# EasyEDA Pro project PCB工程源文件_第一组.eprj

# Schematic Schematic1
Board Name: Board1; Create Date: 2025-12-11; Page Name: P1; Project Name: 高频课设最终版本12-19-3; Schematic Name: Schematic1; Update Date: 2025-12-11; Company: 嘉立创EDA; Page Size: A4; Version: V1.0
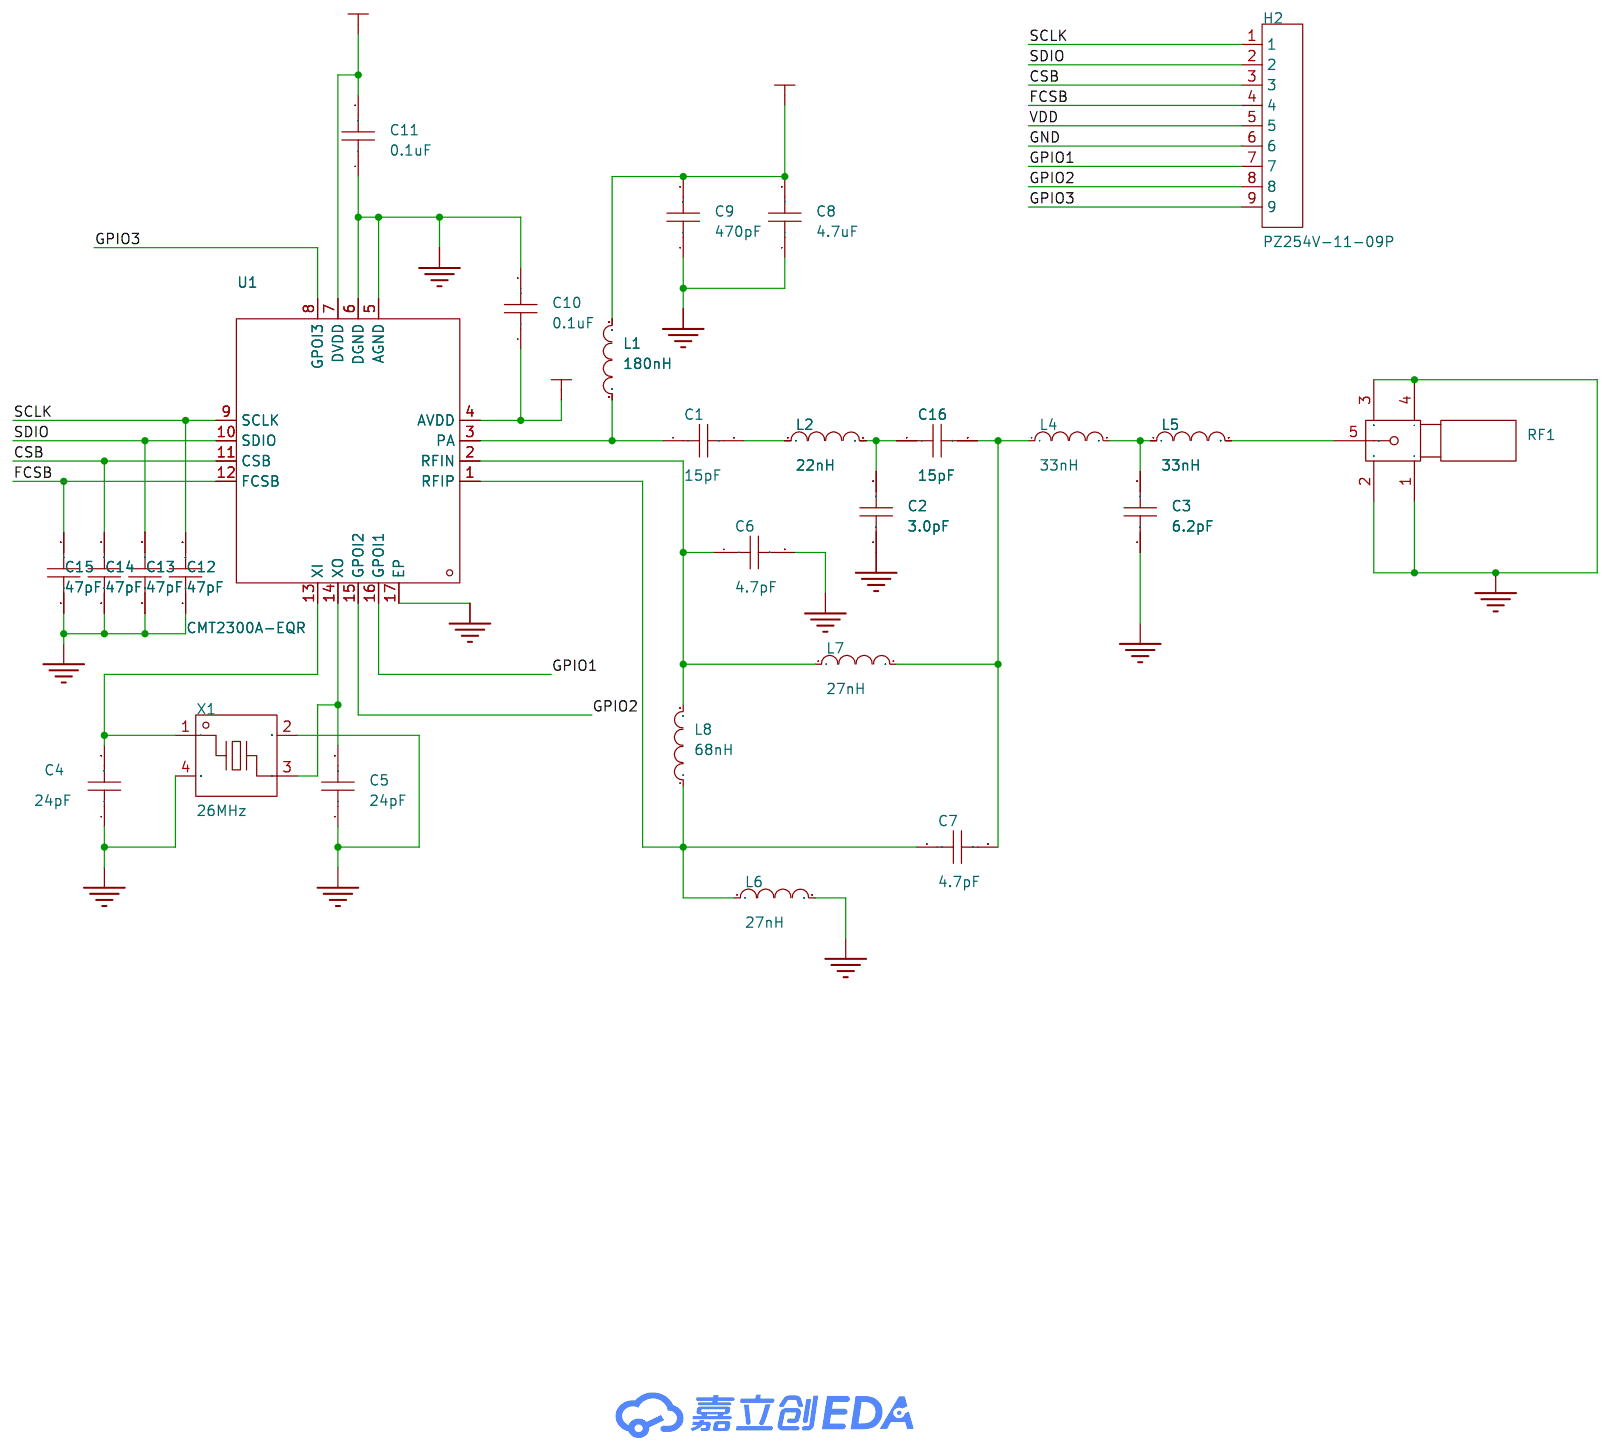
[diagram p0: schematic sheet]

## Parts
C1  15pF  [C0603]
C2  3.0pF  [C0603]
C3  6.2pF  [C0603]
C4  24pF  [C0603]
C5  24pF  [C0603]
C6  4.7pF  [C0603]
C7  4.7pF  [C0603]
C8  4.7uF  [C0603]
C9  470pF  [C0603]
C10  0.1uF  [C0603]
C11  0.1uF  [C0603]
C12  47pF  [C0603]
C13  47pF  [C0603]
C14  47pF  [C0603]
C15  47pF  [C0603]
C16  15pF  [C0603]
H2  PZ254V-11-09P  [HDR-TH_9P-P2.54-V-M]
L1  180nH  [L0603]
L2  22nH  [L0603]
L4  33nH  [L0603]
L5  33nH  [L0603]
L6  27nH  [L0603]
L7  27nH  [L0603]
L8  68nH  [L0603]
RF1  -  [SMA-TH_BWSMA-KE-Z001]
U1  CMT2300A-EQR  [QFN-16_L3.0-W3.0-P0.50-BL-EP1.7]
X1  26MHz  [CRYSTAL-SMD_4P-L3.2-W2.5-BL]

## Library data of the parts
C1-C16 = CAP_0603: Supplier Footprint: 0603
H2 = PZ254V-11-09P: 插针结构:1x9P;间距:2.54mm;行距:-;圆针/方针:方针;安装方式:直插;排数:单排;总PIN位数:9P;额定电流:-;额定电压:-;配合针长度:6mm;塑高:2.5mm;端接针长度:3mm;触头材质:黄铜;触头镀层:-;工作温度:-40℃~+105℃;颜色:黑色;; LCSC Part Name: 1x9P 间距:2.54mm 方针 直插; Supplier Part: C492408; Manufacturer: XFCN(兴飞); Supplier Footprint: 插件,P=2.54mm; JLCPCB Part Class: 扩展库; Datasheet: https://item.szlcsc.com/datasheet/PZ254V-11-09P/502964.html; Supplier: LCSC; Pin Structure: 1x9P; Pitch: 2.54mm; Circluar Pins/Square Pins: 方针; Mounting Type: 直插; Number of Rows: 单排; Number of Pins: 9P; Length of Mating Pin: 6mm; Insulation Height: 2.5mm; Length of End Connection Pin: 3mm; Contact Material: 黄铜; Operating Temperature: -40℃~+105℃; Color: 黑色
L1 L2 L4-L8 = L_0603
RF1 = BWSMA-KE-Z001_C496549: 连接器类型:板端;接口类型:内孔;端口数量:1;接口直径:-;接口长度/高度:-;频率:-;射频系列:SMA;阻抗:50Ω;样式:正脚;工作温度:-65℃~+165℃;; LCSC Part Name: 内孔 SMA 正脚; Supplier Part: C496549; Manufacturer: BAT WIRELESS(蝙蝠无线); Manufacturer Part: BWSMA-KE-Z001; Supplier Footprint: 插件; JLCPCB Part Class: 扩展库; Datasheet: https://item.szlcsc.com/datasheet/BWSMA-KE-Z001/508498.html; Supplier: LCSC; Connector Type: 板端; Interface: 内孔; Number of Ports: 1; RF Series: SMA; Impedance: 50Ω; Style: 正脚; Operating Temperature Range: -65℃~+165℃
U1 = CMT2300A-EQR: 频率范围:127MHz~1.02GHz;接口类型:SPI;应用领域:ISM;数据速率:300Kbps;灵敏度:-121dBm;典型应用频率:433.92MHz;; LCSC Part Name: 超低功耗 Sub-1GHz 射频收发器; Supplier Part: C192930; Manufacturer: HOPERF(华普微电子); Supplier Footprint: QFN-16-EP(3x3); JLCPCB Part Class: 扩展库; Datasheet: https://item.szlcsc.com/datasheet/CMT2300A-EQR/225900.html; Supplier: LCSC; Frequency Range: 127MHz~1.02GHz; Interface: SPI; Voltage - Supply: 1.8V~3.6V; Applications: ISM; Output Power: 20dBm; Data Rate: 300Kbps; Current Of Transmitting: 23mA; Sensitivity: -121dBm; Receive Current: 8.5mA; Typical Application Frequency: 433.92MHz; Operating Temperature: -40℃~+85℃
X1 = TAXM26M4RHBCCT2T: 晶振类型:贴片晶振;频率:26MHz;常温频差:±10ppm;负载电容:15pF;频率稳定度:±15ppm;; LCSC Part Name: 26MHz ±10ppm 15pF; Supplier Part: C516065; Manufacturer: YJX(雅晶鑫); Supplier Footprint: SMD3225-4P; JLCPCB Part Class: 扩展库; Datasheet: https://item.szlcsc.com/datasheet/TAXM26M4RHBCCT2T/531914.html; Supplier: LCSC; Type: 贴片晶振; Normal temperature Frequency Tolerance: ±10ppm; Load Capacitance: 15pF; Frequency Stability: ±15ppm; Equivalent Series Resistance(ESR): 40Ω; Operating Temperature: -40℃~+85℃

## Nets
GND: C2.1 C3.1 C4.1 C5.1 C6.2 C8.1 C9.1 C10.2 C11.1 C12.1 C13.1 C14.1 C15.1 H2.6 L6.2 RF1.1 RF1.2 RF1.3 RF1.4 U1.5(AGND) U1.6(DGND) U1.17(EP) X1.2(GND) X1.4(GND)
VDD: C8.2 C9.2 C10.1 C11.2 H2.5 L1.2 U1.4(AVDD) U1.7(DVDD)
CSB: C14.2 H2.3 U1.11(CSB)
FCSB: C15.2 H2.4 U1.12(FCSB)
GPIO1: H2.7 U1.16(GPOI1)
GPIO2: H2.8 U1.15(GPOI2)
GPIO3: H2.9 U1.8(GPOI3)
SCLK: C12.2 H2.1 U1.9(SCLK)
SDIO: C13.2 H2.2 U1.10(SDIO)
$1N691: C4.2 U1.13(XI) X1.1
$1N1791: C1.1 L1.1 U1.3(PA)
$1N1847: C1.2 L2.1
$1N1852: C2.2 C16.1 L2.2
$1N1857: C7.2 C16.2 L4.1 L7.2
$1N1862: C3.2 L4.2 L5.1
$1N1900: C6.1 L7.1 L8.2 U1.2(RFIN)
$1N2046: C7.1 L6.1 L8.1 U1.1(RFIP)
$1N3838: L5.2 RF1.5
$1N5992: C5.2 U1.14(XO) X1.3

# Board PCB1
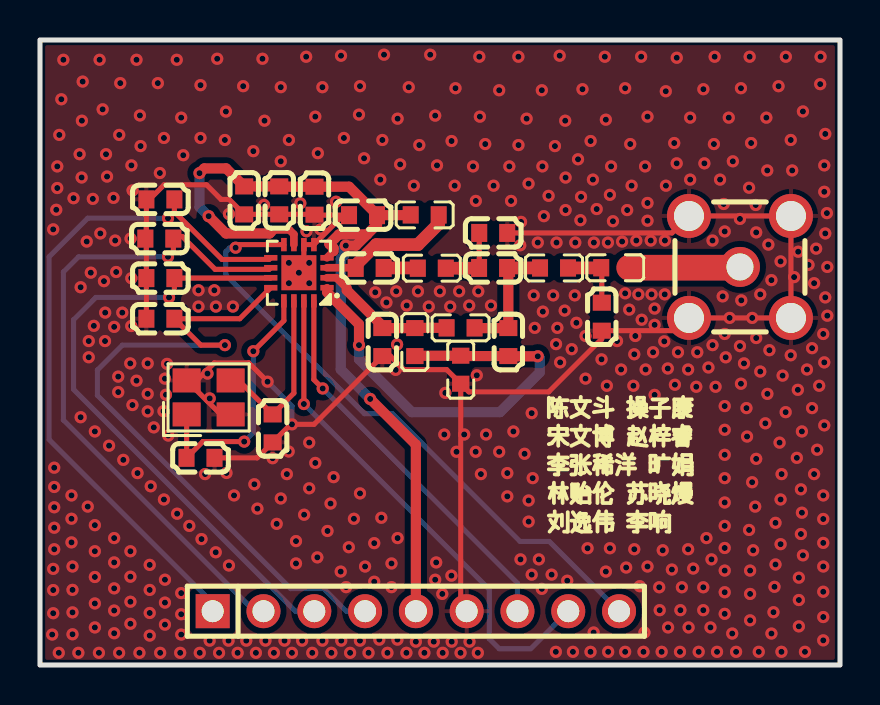
[diagram p1: board, top side]
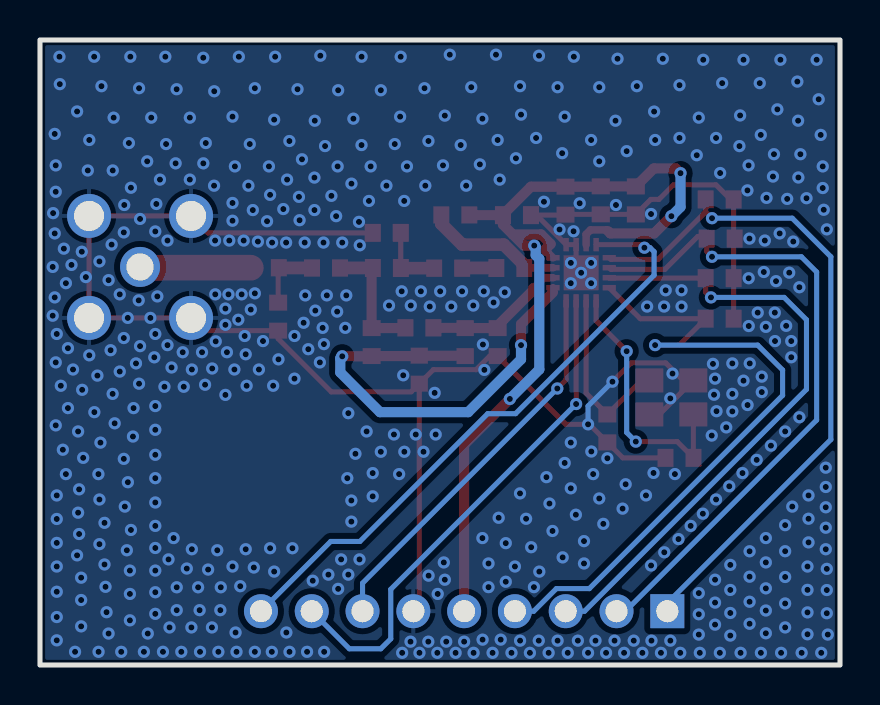
[diagram p2: board, bottom side, seen from below]

Outline 40.01 x 31.27 mm; copper layers: Top Layer, Bottom Layer. Coordinates in mm from the lower left corner of the outline.
Outline path: rectangle 40.01,0 0,31.27
Stack: Top Layer 0.035mm / Dielectric1 1.51mm FR4 er 4.5 / Bottom Layer 0.035mm

## Design rules (mm)
template: 自定义配置
spacing copperThickness1oz (default): track to track 0.102, other pairs 0.152 to 0.3
spacing copperThickness2oz: track to track 0.203, other pairs 0.152 to 0.3
track width copperThickness1oz (default): min 0.127, default 0.254, max 2.54
track width copperThickness2oz: min 0.203, default 0.254, max 2.54
differential pair differentialPair (default): width min 0.127, default 0.254, max 2.54; gap min 0.152, default 0.152
via viaSize (default): diameter min 0.5, default 0.61, max 10; hole min 0.3, default 0.305, max 6.3
net GND uses copperRegion1

## Placement (name value [footprint] x y rotation side)
C1  15pF  [C0603]  16.48 19.86 0 top
C2  3.0pF  [C0603]  22.66 21.62 180 top
C3  6.2pF  [C0603]  28.09 17.42 90 top
C4  24pF  [C0603]  8.03 10.36 180 top
C5  24pF  [C0603]  11.63 11.84 90 top
C6  4.7pF  [C0603]  17.12 16.15 270 top
C7  4.7pF  [C0603]  23.42 16.15 90 top
C8  4.7uF  [C0603]  13.73 23.23 90 top
C9  470pF  [C0603]  16.15 22.5 0 top
C10  0.1uF  [C0603]  11.96 23.24 270 top
C11  0.1uF  [C0603]  10.21 23.24 90 top
C12  47pF  [C0603]  6.02 23.29 0 top
C13  47pF  [C0603]  5.97 21.33 0 top
C14  47pF  [C0603]  6.02 19.35 0 top
C15  47pF  [C0603]  6.02 17.32 0 top
C16  15pF  [C0603]  22.66 19.86 0 top
H2  PZ254V-11-09P  [HDR-TH_9P-P2.54-V-M]  18.8 2.69 0 top
L1  180nH  [L0603]  19.24 22.52 180 top
L2  22nH  [L0603]  19.59 19.85 0 top
L4  33nH  [L0603]  25.7 19.86 0 top
L5  33nH  [L0603]  28.76 19.87 0 top
L6  27nH  [L0603]  21.04 14.77 270 top
L7  27nH  [L0603]  21.03 16.87 0 top
L8  68nH  [L0603]  18.75 16.15 90 top
RF1  -  [SMA-TH_BWSMA-KE-Z001]  35 19.91 0 top
U1  CMT2300A-EQR  [QFN-16_L3.0-W3.0-P0.50-BL-EP1.7]  12.95 19.62 90 top
X1  26MHz  [CRYSTAL-SMD_4P-L3.2-W2.5-BL]  8.43 13.39 0 top

## Footprints (pads in the part's own frame, mm; a bottom-side part is the same pattern mirrored in y, then rotated)
C0603
  rect 0.8x0.9 smd: 1(-0.7,0) 2(0.7,0)
CRYSTAL-SMD_4P-L3.2-W2.5-BL
  rect 1.4x1.2 smd: 1(-1.1,-0.85) 2(1.1,-0.85) 3(1.1,0.85) 4(-1.1,0.85)
HDR-TH_9P-P2.54-V-M
  rect 1.7x1.7 hole 1.1: 1(-10.16,0)
  round 1.7 hole 1.1: 2(-7.62,0) 3(-5.08,0) 4(-2.54,0) 5(0,0) 6(2.54,0) 7(5.08,0) 8(7.62,0) 9(10.16,0)
L0603
  rect 0.8x0.864 smd: 1(-0.7,0) 2(0.7,0)
QFN-16_L3.0-W3.0-P0.50-BL-EP1.7
  rect 0.28x0.665 smd: 1(-0.75,-1.407) 2(-0.25,-1.407) 3(0.25,-1.407) 4(0.75,-1.407) 9(0.75,1.407) 10(0.25,1.407) 11(-0.25,1.407) 12(-0.75,1.407)
  rect 0.665x0.28 smd: 5(1.407,-0.75) 6(1.407,-0.25) 7(1.407,0.25) 8(1.407,0.75) 13(-1.407,0.75) 14(-1.407,0.25) 15(-1.407,-0.25) 16(-1.407,-0.75)
  rect 1.75x1.75 smd: 17(0,0)
SMA-TH_BWSMA-KE-Z001
  round 2.2 hole 1.5: 1(-2.55,-2.55) 2(-2.55,2.55) 3(2.55,2.55) 4(2.55,-2.55)
  round 2 hole 1.35: 5(0,0)

## Nets
As in the schematic.

## Via types
v1: diameter 0.61, hole 0.305, Top Layer to Bottom Layer, 552 vias

## Routing (per net, layer and track width the routed paths; a pad name or vN(x,y) marks a point on that pad's centre or on a via; arc(x,y) is an arc through that point)
GND: length 96.1
  Top Layer w0.254: 15.17,22.5 U1.5 U1.6 13.2,19.87 v1(12.95,19.62) ; 15.17,22.5 13.75,22.5 C8.1 13.71,22.54 C10.2 10.21,22.54 C11.1 9.46,23.29 9.05,23.29 8.33,24.02 6.2,24.02 5.48,23.29 C12.1 5.32,21.38 C13.1 5.32,21.28 C14.1 C15.1 ; 15.17,22.5 C9.1 ; C4.1 10.86,10.36 C5.1 12.54,12.04 v1(12.6,12.04) 13.7,12.04 C6.2 17.52,15.45 18.2,14.78 20.34,14.78 L6.2 ; C2.1 31.6,21.62 RF1.2 RF1.3 RF1.4 v1(35.62,17.36) v1(34.48,17.36) RF1.1 31.81,16.72 C3.1 28.09,16.32 25.44,13.67 21.45,13.67 L6.2 ; X1.2 9.03,12.54 X1.4 7.84,14.24 8.72,15.11 10.44,15.11 v1(11.38,14.17) ; L6.2 21.04,2.99 H2.6
  Bottom Layer w0.254: v1(11.38,14.17) 12.6,12.95 v1(12.6,12.04)
  vias: v1(0.61,1.52) v1(0.66,21.79) v1(0.71,9.87) v1(0.71,8.91) v1(0.71,7.89) v1(0.71,6.87) v1(0.71,5.79) v1(0.66,4.81) v1(0.66,3.75) v1(0.66,2.59) v1(0.81,22.77) v1(0.86,24.94) v1(0.86,23.86) v1(0.94,0.61) v1(0.97,26.52) v1(1.07,28.3) v1(1.17,30.28) v1(1.58,8.48) v1(1.58,7.32) v1(1.58,6.13) v1(1.63,4.93) v1(1.63,3.76) v1(1.63,2.63) v1(1.63,1.54) v1(1.68,23.35) v1(1.92,0.61) v1(1.98,25.55) v1(2.03,18.9) v1(2.03,12.4) v1(2.13,29.19) v1(2.09,27.23) v1(2.08,24.39) v1(2.34,21.18) v1(2.44,16.21) v1(2.44,15.4) v1(2.39,7.92) v1(2.54,19.63) v1(2.64,23.32) v1(2.69,16.97) v1(2.74,11.68) v1(2.74,7) v1(2.74,5.69) v1(2.74,4.4) v1(2.74,3.08) v1(2.74,1.88) v1(2.98,30.28) v1(3.02,21.59) v1(2.95,0.61) v1(3.13,27.8) v1(3.2,19.2) v1(3.3,25.55) v1(3.26,17.63) v1(3.25,16.21) v1(3.35,24.44) v1(3.45,10.97) v1(3.68,23.37) v1(3.71,16.92) v1(3.71,6.35) v1(3.71,5.13) v1(3.71,3.83) v1(3.71,2.73) v1(3.71,1.59) v1(3.76,21.23) v1(3.81,19.66) v1(3.91,14.43) v1(3.91,13.65) v1(4.01,29.11) v1(3.96,26.52) v1(3.96,0.61) v1(4.11,17.63) v1(4.17,10.26) v1(4.53,21.33) v1(4.51,15.09) v1(4.52,5.69) v1(4.52,4.42) v1(4.52,3.17) v1(4.52,2.06) v1(4.57,24.99) v1(4.63,23.74) v1(4.57,19.35) v1(4.56,16.96) v1(4.62,13) v1(4.83,30.28) v1(4.83,14.22) v1(4.88,9.6) v1(5,27.49) v1(5.03,25.96) v1(4.97,0.61) v1(5.39,15.09) v1(5.39,13.56) v1(5.39,12.69) v1(5.54,8.94) v1(5.49,5.01) v1(5.49,3.76) v1(5.49,2.6) v1(5.49,1.47) v1(5.69,11.89) v1(5.89,29.11) v1(5.99,24.61) v1(6.01,0.61) v1(6.2,26.37) v1(6.18,12.7) v1(6.2,8.28) v1(6.25,14.33) v1(6.3,13.52) v1(6.25,4.27) v1(6.25,3.12) v1(6.25,2.02) v1(6.35,15.06) v1(6.41,11.48) v1(6.84,30.28) v1(6.86,7.57) v1(7.01,0.61) v1(7.06,27.38) v1(7.06,3.6) v1(7.06,2.54) v1(7.06,1.52) v1(7.16,25.5) v1(7.47,6.96) v1(7.92,18.75) v1(7.92,17.93) v1(8.03,29.01) v1(8.03,26.37) v1(7.99,0.61) v1(8.08,6.3) v1(8.26,9.55) v1(8.38,14.58) v1(8.49,13.34) v1(8.48,1.22) v1(8.72,18.75) v1(8.8,17.93) v1(8.79,5.64) v1(8.86,30.33) v1(8.95,0.61) v1(9.3,27.69) v1(9.24,26.26) v1(9.33,9.61) v1(9.43,1.22) v1(9.45,22.56) v1(9.45,4.98) v1(9.65,17.93) v1(9.7,8.48) v1(9.88,0.61) v1(10.16,28.96) v1(10.31,1.22) v1(10.67,25.7) v1(10.72,9.04) v1(10.8,0.61) v1(10.87,7.82) v1(11.13,30.33) v1(11.23,27.23) v1(11.2,23.01) v1(11.27,1.22) v1(11.63,10.34) v1(11.7,0.61) v1(11.84,7.06) v1(12.04,28.91) v1(12.04,25.2) v1(12.04,8.33) v1(12.23,1.22) v1(12.43,10.68) v1(12.34,9.55) v1(12.45,26.26) v1(12.45,20.12) v1(12.45,19.1) v1(12.6,0.61) v1(12.8,6.2) v1(12.8,5.08) v1(13.02,23.1) v1(13.11,1.22) v1(13.21,7.52) v1(13.31,30.43) v1(13.32,21.7) v1(13.46,20.12) v1(13.46,19.1) v1(13.46,11.13) v1(13.46,8.84) v1(13.61,0.61) v1(13.77,27.43) v1(13.77,10.11) v1(13.89,25.6) v1(13.87,5.38) v1(14.03,21.79) v1(14.12,28.91) v1(14.12,1.22) v1(14.38,6.71) v1(14.53,8.08) v1(14.57,0.61) v1(14.68,9.4) v1(14.8,23.17) v1(15.04,4.67) v1(15.05,30.48) v1(15.06,1.22) v1(15.2,26.37) v1(15.31,3.89) v1(15.44,5.89) v1(15.51,0.61) v1(15.7,7.32) v1(16,28.96) v1(15.95,27.53) v1(16,8.59) v1(16,1.22) v1(16.21,25.35) v1(16.26,4.93) v1(16.43,0.61) v1(16.71,6.1) v1(16.71,4.17) v1(16.76,18.64) v1(17.02,24.28) v1(16.97,1.27) v1(17.12,26.26) v1(17.07,7.37) v1(17.2,30.53) v1(17.32,18.14) v1(17.37,0.61) v1(17.58,5.08) v1(17.58,3.89) v1(17.81,18.69) v1(17.79,14.76) v1(17.88,27.33) v1(17.86,16.03) v1(17.88,6.35) v1(17.87,1.27) v1(18.01,25.04) v1(18.34,17.98) v1(18.32,0.61) v1(18.44,28.91) v1(18.69,23.98) v1(18.8,1.17) v1(18.9,18.69) v1(18.97,26.01) v1(19.22,0.61) v1(19.44,17.93) v1(19.51,30.53) v1(19.69,1.17) v1(19.76,27.48) v1(19.81,5.13) v1(19.76,4.27) v1(19.85,24.99) v1(19.99,18.69) v1(20.12,3.56) v1(20.14,0.61) v1(20.22,11.53) v1(20.27,13.61) v1(20.51,17.93) v1(20.58,26.21) v1(20.57,4.47) v1(20.59,1.17) v1(20.74,23.98) v1(20.78,28.85) v1(20.83,10.67) v1(20.96,18.69) v1(21.03,0.61) v1(21.21,11.53) v1(21.46,17.98) v1(21.48,1.17) v1(21.65,24.94) v1(21.79,23.22) v1(21.84,14.49) v1(21.79,10.67) v1(21.92,18.69) v1(21.89,0.61) v1(21.97,30.43) v1(22,27.43) v1(22.05,9.55) v1(22.26,26.06) v1(22.3,11.53) v1(22.55,17.98) v1(22.68,23.98) v1(22.96,28.75) v1(22.96,10.67) v1(23.37,9.6) v1(23.37,8.44) v1(23.47,24.94) v1(23.56,23.22) v1(23.67,11.68) v1(23.92,30.43) v1(23.93,26.01) v1(24.01,21) v1(24.03,5.28) v1(24.05,22.17) v1(24.23,10.57) v1(24.33,27.33) v1(24.43,24.08) v1(24.43,8.23) v1(24.43,7.17) v1(24.59,12.6) v1(24.64,9.35) v1(24.59,4.52) v1(24.69,18.49) v1(24.74,16.87) v1(24.89,21.13) v1(24.95,5.28) v1(25.1,28.75) v1(25.12,24.94) v1(25.1,3.81) v1(25.2,22.45) v1(25.15,17.68) v1(25.43,23.47) v1(25.58,4.52) v1(25.66,18.49) v1(25.75,25.96) v1(25.83,21.13) v1(25.81,16.05) v1(25.8,0.66) v1(25.87,16.87) v1(25.99,30.48) v1(26.01,15.14) v1(26.24,17.73) v1(26.26,27.23) v1(26.28,24.38) v1(26.28,22.76) v1(26.37,4.22) v1(26.59,15.8) v1(26.74,18.49) v1(26.65,0.66) v1(26.77,21.13) v1(26.82,17.12) v1(26.9,25.3) v1(27.02,22.25) v1(27.13,28.8) v1(27.06,23.42) v1(27.28,16.46) v1(27.28,14.33) v1(27.38,5.84) v1(27.53,26.21) v1(27.53,0.66) v1(27.65,24.28) v1(27.7,21.13) v1(27.69,1.63) v1(27.84,22.81) v1(28.08,15.29) v1(28.25,30.43) v1(28.3,27.28) v1(28.3,4.67) v1(28.4,21.13) v1(28.35,13.97) v1(28.41,0.66) v1(28.5,23.52) v1(28.5,5.84) v1(28.56,24.94) v1(28.65,22.2) v1(28.85,16.21) v1(29.11,21.18) v1(29.06,14.78) v1(29.26,28.85) v1(29.26,18.59) v1(29.31,4.88) v1(29.26,0.66) v1(29.36,22.76) v1(29.52,26.06) v1(29.46,17.78) v1(29.58,23.98) v1(29.72,15.55) v1(29.67,13.97) v1(29.72,5.79) v1(29.82,21.23) v1(29.77,16.46) v1(29.92,18.54) v1(29.99,3.94) v1(30.06,30.43) v1(30.09,17.27) v1(30.23,1.63) v1(30.18,0.66) v1(30.26,24.94) v1(30.28,14.78) v1(30.38,27.43) v1(30.38,23.11) v1(30.38,22.23) v1(30.38,4.93) v1(30.54,21.23) v1(30.58,18.54) v1(30.73,17.83) v1(30.73,17.02) v1(30.66,15.65) v1(30.73,13.51) v1(30.96,3.89) v1(30.99,2.74) v1(31.14,5.74) v1(31.09,0.66) v1(31.24,18.54) v1(31.22,16.19) v1(31.29,28.7) v1(31.3,23.98) v1(31.25,21.23) v1(31.39,14.83) v1(31.41,1.88) v1(31.6,4.78) v1(31.71,26.11) v1(31.84,30.38) v1(31.84,25.1) v1(31.75,14.02) v1(31.9,15.65) v1(32.02,2.74) v1(32,0.66) v1(32.1,3.89) v1(32.41,14.78) v1(32.41,5.79) v1(32.43,1.88) v1(32.51,27.38) v1(32.51,24.28) v1(32.66,4.83) v1(32.82,13.92) v1(32.87,15.65) v1(32.94,0.66) v1(33.17,28.8) v1(33.22,25.1) v1(33.17,3.89) v1(33.17,2.74) v1(33.33,6.35) v1(33.43,14.88) v1(33.53,1.88) v1(33.63,21.23) v1(33.63,16) v1(33.58,5.28) v1(33.74,30.43) v1(33.7,26.06) v1(33.78,13.92) v1(33.86,0.66) v1(34.01,24.28) v1(34.14,18.44) v1(34.19,23.06) v1(34.24,21.69) v1(34.24,16.56) v1(34.24,12.95) v1(34.24,11.77) v1(34.24,10.52) v1(34.24,9.35) v1(34.24,8.13) v1(34.24,6.96) v1(34.24,5.85) v1(34.24,4.72) v1(34.24,3.64) v1(34.24,2.56) v1(34.29,15.39) v1(34.44,27.38) v1(34.62,1.57) v1(34.65,25.2) v1(34.81,0.66) v1(35,22.32) v1(35,15.95) v1(35.05,28.85) v1(35.07,18.24) v1(35.05,14.07) v1(35.2,15.09) v1(35.33,12.85) v1(35.36,11.43) v1(35.49,30.43) v1(35.46,23.88) v1(35.46,6.76) v1(35.51,4.72) v1(35.51,3.56) v1(35.51,2.24) v1(35.56,26.11) v1(35.61,9.14) v1(35.66,5.74) v1(35.79,23.01) v1(35.81,21.64) v1(35.81,16.36) v1(35.81,10.31) v1(35.76,7.92) v1(36.02,18.54) v1(36.02,14.68) v1(35.94,0.66) v1(36.32,27.38) v1(36.27,12.09) v1(36.37,24.74) v1(36.42,21.03) v1(36.37,13.56) v1(36.47,15.75) v1(36.58,19.25) v1(36.58,1.57) v1(36.73,3.91) v1(36.68,2.64) v1(36.78,7.11) v1(36.78,5.03) v1(36.93,28.96) v1(37.03,20.19) v1(36.98,11.13) v1(37.03,8.28) v1(37.03,6.05) v1(37.14,14.48) v1(37.08,9.55) v1(37.08,0.66) v1(37.3,30.43) v1(37.29,12.65) v1(37.54,26.26) v1(37.54,15.49) v1(37.61,24.74) v1(37.71,19.41) v1(37.91,20.67) v1(37.9,13.77) v1(37.85,10.36) v1(37.95,4.37) v1(37.95,3.25) v1(37.95,1.93) v1(38.1,11.68) v1(38.05,8.79) v1(38.1,7.62) v1(38.05,6.55) v1(38.15,27.69) v1(38.15,5.49) v1(38.25,0.66) v1(38.43,20.02) v1(38.35,14.78) v1(38.61,15.85) v1(38.61,12.85) v1(38.71,19.1) v1(38.71,9.55) v1(38.81,20.83) v1(38.86,10.77) v1(39.03,30.43) v1(39.01,29.06) v1(38.96,13.97) v1(39.22,24.99) v1(39.22,23.67) v1(39.17,16.56) v1(39.22,15.14) v1(39.22,11.99) v1(39.17,8.48) v1(39.17,7.3) v1(39.17,6.11) v1(39.17,4.93) v1(39.17,3.66) v1(39.17,2.4) v1(39.17,1.23) v1(39.27,26.57) v1(39.27,21.59) v1(39.27,18.39) v1(39.35,22.61) v1(39.37,19.91) v1(39.37,17.48)
VDD: length 44.7
  Top Layer w0.381: 11.58,21.69 11.66,21.77 12.47,21.77 12.7,21.54 U1.7 ; U1.4 14.68,20.7
  Top Layer w0.508: v1(8.43,22.45) 9.3,21.59 11.48,21.59 11.58,21.69 ; C9.2 18.52,22.5 L1.2 ; C9.2 16.85,22.04 16.36,21.54 ; C9.2 16.85,22.53 15.46,23.93 C8.2 11.98,23.93 C10.1 11.96,23.94 C11.2 9.31,24.84 8.21,24.84 v1(7.98,24.6) ; v1(15.29,20.98) 15.8,20.98 16.36,21.54 ; H2.5 18.8,11.02 v1(16.51,13.31) ; 16.36,21.54 14.95,21.54 14.47,21.06 14.68,20.85 14.68,20.7
  Bottom Layer w0.508: v1(16.51,13.31) 15.04,14.78 15.04,20.32 15.22,20.5 15.22,20.91 v1(15.29,20.98) ; v1(7.98,24.6) 7.98,22.91 v1(8.43,22.45)
CSB: length 31.3
  Top Layer w0.254: v1(6.45,18.39) 6.72,18.66 C14.2 11.52,19.35 U1.11
  Bottom Layer w0.254: v1(6.45,18.39) 2.79,18.39 1.68,17.27 1.68,13.79 12.77,2.69 H2.3
FCSB: length 34.6
  Top Layer w0.254: U1.12 9.99,17.32 C15.2 8.04,16 v1(9.25,16)
  Bottom Layer w0.254: v1(9.25,16) 4.11,16 2.87,14.76 2.87,13.49 12.54,3.82 14.18,3.82 15.31,2.69 H2.4
GPIO1: length 19.7
  Top Layer w0.254: U1.16 13.7,14.27 v1(14.14,13.83)
  Bottom Layer w0.254: v1(14.14,13.83) 23.88,4.09 H2.7
GPIO2: length 25.7
  Top Layer w0.254: U1.15 v1(13.2,13.06)
  Bottom Layer w0.254: H2.8 24.54,0.81 22.96,0.81 22.46,1.31 22.46,3.79 v1(13.2,13.06)
GPIO3: length 30.8
  Top Layer w0.254: v1(9.78,20.88) 9.94,21.03 U1.8
  Bottom Layer w0.254: v1(9.78,20.88) 9.5,20.88 9.3,20.68 9.3,19.5 16.22,12.57 17.62,12.57 24.01,6.18 25.47,6.18 H2.9
SCLK: length 34.8
  Top Layer w0.254: 6.72,22.67 v1(6.4,22.35) ; 6.72,22.67 C12.2 ; 6.72,22.67 9.1,20.29 11.46,20.29 U1.9
  Bottom Layer w0.254: v1(6.4,22.35) 2.39,22.35 0.46,20.42 0.46,11.28 8.64,3.1 H2.1
SDIO: length 33.6
  Top Layer w0.254: v1(6.4,20.42) 6.67,20.69 C13.2 6.77,21.44 7.11,21.44 8.76,19.79 11.46,19.79 U1.10
  Bottom Layer w0.254: v1(6.4,20.42) 1.93,20.42 1.17,19.66 1.17,12.25 10.73,2.69 H2.2
$1N691: length 13.2
  Top Layer w0.254: U1.13 12.2,17.22 v1(10.67,15.7) ; 7.33,10.37 C4.2 ; 7.33,10.37 X1.1 ; 7.33,10.37 8.14,11.18 v1(10.21,11.18)
  Bottom Layer w0.254: v1(10.21,11.18) 10.67,11.63 v1(10.67,15.7)
$1N1791: length 7
  Top Layer w0.381: C1.1 15.77,19.87 U1.3
  Top Layer w0.635: L1.1 19.94,22.07 18.9,21.03 16.82,21.03 15.79,20 C1.1
$1N1847: length 1.7
  Top Layer w0.635: L2.1 18.88,19.86 C1.2
$1N1852: length 3.4
  Top Layer w0.254: C2.2 21.96,19.87
  Top Layer w0.635: L2.2 21.94,19.85 C16.1
$1N1857: length 6.4
  Top Layer w0.508: L7.2 21.74,16.85 C7.2 23.42,19.8 C16.2
  Top Layer w0.635: C16.2 L4.1
$1N1862: length 3.4
  Top Layer w0.254: C3.2 28.09,19.85 L5.1
  Top Layer w0.635: L4.2 28.05,19.86 L5.1
$1N1900: length 7.2
  Top Layer w0.381: U1.2 14.82,19.37 15.34,18.85
  Top Layer w0.508: 15.34,18.85 15.34,18.75 17.12,16.97 C6.1 L8.2 18.76,16.87 L7.1
$1N2046: length 22.2
  Top Layer w0.381: U1.1 14.35,18.64
  Top Layer w0.508: v1(24.89,15.44) 23.43,15.44 C7.1 21.06,15.45 L6.1 18.76,15.47 L8.1 ; 14.35,18.64 15.95,17.05 v1(15.95,16)
  Bottom Layer w0.508: v1(15.95,16) 15.95,15.29 18.59,12.65 23,12.65 24.99,14.64 24.99,15.35 v1(24.89,15.44)
$1N3838: length 5.6
  Top Layer w1.284: L5.2 34.96,19.87 RF1.5
$1N5992: length 8.9
  Top Layer w0.254: X1.3 9.93,14.24 C5.2 12.7,13.6 U1.14

## Copper pours and planes (outline as drawn; the poured copper is in the pictures)
GND on Top Layer: -4.83,34.34 44.76,34.34 44.76,-5.13 -4.83,-5.13
GND on Bottom Layer: -3.71,35 46.99,35 46.99,-4.47 -3.71,-4.47

## Text on the board
Top Silkscreen Layer: 陈文斗 操子康 / 宋文博 赵梓睿 / 李张稀洋 旷娟 / 林贻伦 苏晓熳 / 刘逸伟 李响
